# EAGLE schematic damp_orig (EAGLE 6.4)
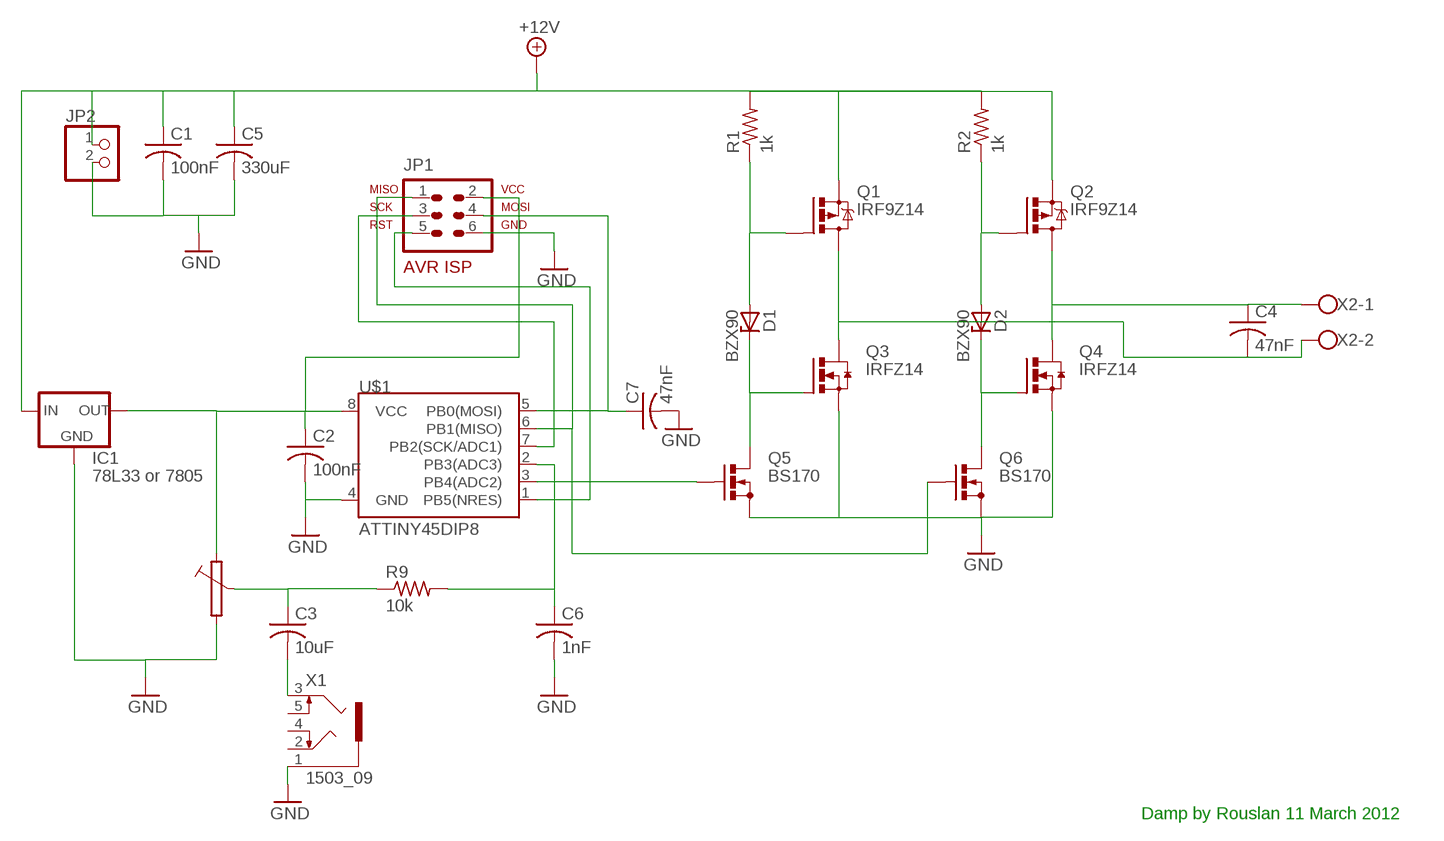
[diagram p0: schematic, sheet 1]

## Parts
C1  100nF  C-US025-025X050  [C025-025X050]
C2  100nF  C-US025-025X050  [C025-025X050]
C3  10uF  C-US025-025X050  [C025-025X050]
C4  47nF  C-US025-025X050  [C025-025X050]
C5  330uF  C-US025-025X050  [C025-025X050]
C6  1nF  C-US025-025X050  [C025-025X050]
C7  47nF  C-US025-025X050  [C025-025X050]
D1  BZX90  [DO34Z7]
D2  BZX90  [DO34Z7]
IC1  78L33 or 7805  V_REG_78XXTO-92  [TO-92]
JP1  AVR-ISP-6VERT  [AVR-ISP-6]
JP2  PINHD-1X2  [1X02]
Q1  IRF9Z14  IRF9530  [TO220BV]
Q2  IRF9Z14  IRF9530  [TO220BV]
Q3  IRFZ14  IRF3704L-V  [TO262-V]
Q4  IRFZ14  IRF3704L-V  [TO262-V]
Q5  BS170  [SOT54E]
Q6  BS170  [SOT54E]
R1  1k  R-US_0204/7  [0204/7]
R2  1k  R-US_0204/7  [0204/7]
R9  10k  R-US_0309/10  [0309/10]
U$1  ATTINY45DIP8  [DIP08]
X1  1503_09  [1503_09]
X2  W237-102  [W237-102]

## Nets
+12V: C1.1 C5.1 IC1.2(IN) JP2.1 Q1.S Q2.S R1.2 R2.2
GND: C1.2 C2.2 C5.2 C6.2 C7.2 IC1.1(GND) JP1.6 JP2.2 Q3.3(S) Q4.3(S) Q5.S Q6.S U$1.4(GND) X1.1
N$1: D1.A Q1.G R1.1
N$2: D2.A Q2.G R2.1
N$3: C4.2 Q1.D Q3.2(D) X2.2
N$4: JP1.5 U$1.1(PB5(NRES))
N$5: C4.1 Q2.D Q4.2(D) X2.1
N$7: D1.C Q3.1(G) Q5.D
N$8: D2.C Q4.1(G) Q6.D
N$10: C6.1 R9.2 U$1.2(PB3(ADC3))
N$11: JP1.4 U$1.5(PB0(MOSI))
N$12: C2.1 IC1.3(OUT) JP1.2 U$1.8(VCC)
N$13: JP1.1 Q6.G U$1.6(PB1(MISO))
N$14: JP1.3 U$1.7(PB2(SCK/ADC1))
N$15: C3.1 R9.1
N$18: Q5.G U$1.3(PB4(ADC2))
N$19: C7.1
N$23: C3.2 X1.3
Unconnected: X1.2 X1.4 X1.5

## Notes on the sheet
- Damp by Rouslan 11 March 2012

## Library data of the parts
C1-C7 = rcl:C-US: CAPACITOR, American symbol
D1 D2 = diode:BZX90: Z DIODE
IC1 = SparkFun:V_REG_78XX: Voltage Regulator Standard 7805 5V regulator. IGO (Input Ground Output). Spark Fun Electronics SKU : COM-00107
JP1 = avr-7:AVR-ISP-6: AVR ISP-6 Serial Programming Header
JP2 = pinhead:PINHD-1X2: PIN HEADER
Q1 Q2 = transistor-power:IRF9530: P-CHANNEL HEXFET POWER-MOS-FET Source: http://www.irf.com/product-info/datasheets/data/irf9530.pdf
Q3 Q4 = transistor-power:IRF3704: SMPS MOSFET HEXFET® Power MOSFET Source: http://www.irf.com/product-info/datasheets/data/irf3704.pdf
Q5 Q6 = transistor-small-signal:BS170: N-CHANNEL MOS FET
R1 R2 R9 = rcl:R-US_: RESISTOR, American symbol
U$1 = SparkFun:ATTINY45: Atmel ATTiny45
X1 = con-lumberg:1503_09: Jack connectors according to JISC 6560, 3.5 mm Klinkeneinbaukupplung nach JISC 6560, 3,5 mm, 3-polig/ stereo, abgewinkelte Ausführung, mit 2 Öffnern und Lötaugen, für Leiterplatten Rückseitenmontage Source: http://www.lumberg.com/Produkte/PDFs/1503_09.pdf
X2 = con-wago-500:W237-102: WAGO SCREW CLAMP; MPN: 237-102; OC_FARNELL: unknown; OC_NEWARK: 70K9898

## Net classes
1 Power: width 0.508 mm